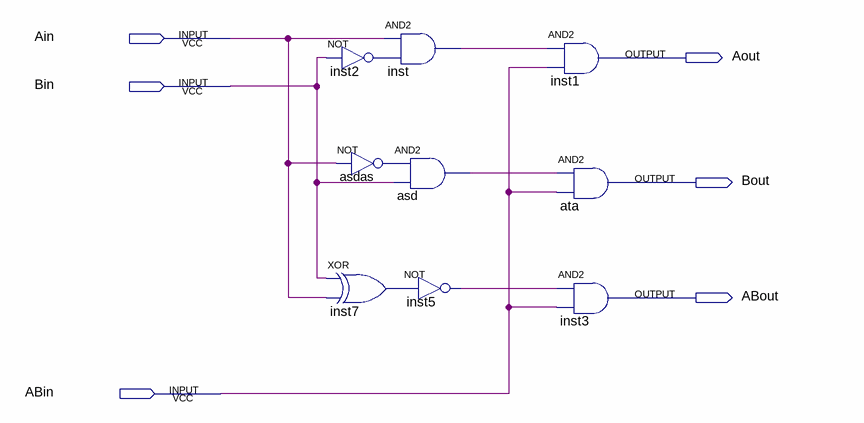
[diagram p0: schematic sheet]
// Quartus schematic compara.bdf as structural Verilog: 9 symbols, 6 pins
module compara (
  input  Ain,
  input  Bin,
  input  ABin,
  output Aout,
  output Bout,
  output ABout
);

  wire asd_out, asdas_out, inst2_out, inst5_out, inst7_out, inst_out;

  not inst2 (inst2_out, Bin);
  not asdas (asdas_out, Ain);
  xor inst7 (inst7_out, Bin, Ain);
  and inst (inst_out, Ain, inst2_out);
  and asd (asd_out, asdas_out, Bin);
  not inst5 (inst5_out, inst7_out);
  and inst1 (Aout, inst_out, ABin);
  and ata (Bout, asd_out, ABin);
  and inst3 (ABout, inst5_out, ABin);
endmodule
